# Altium schematic sheet etapa1_anger_Y.SchDoc
size A4
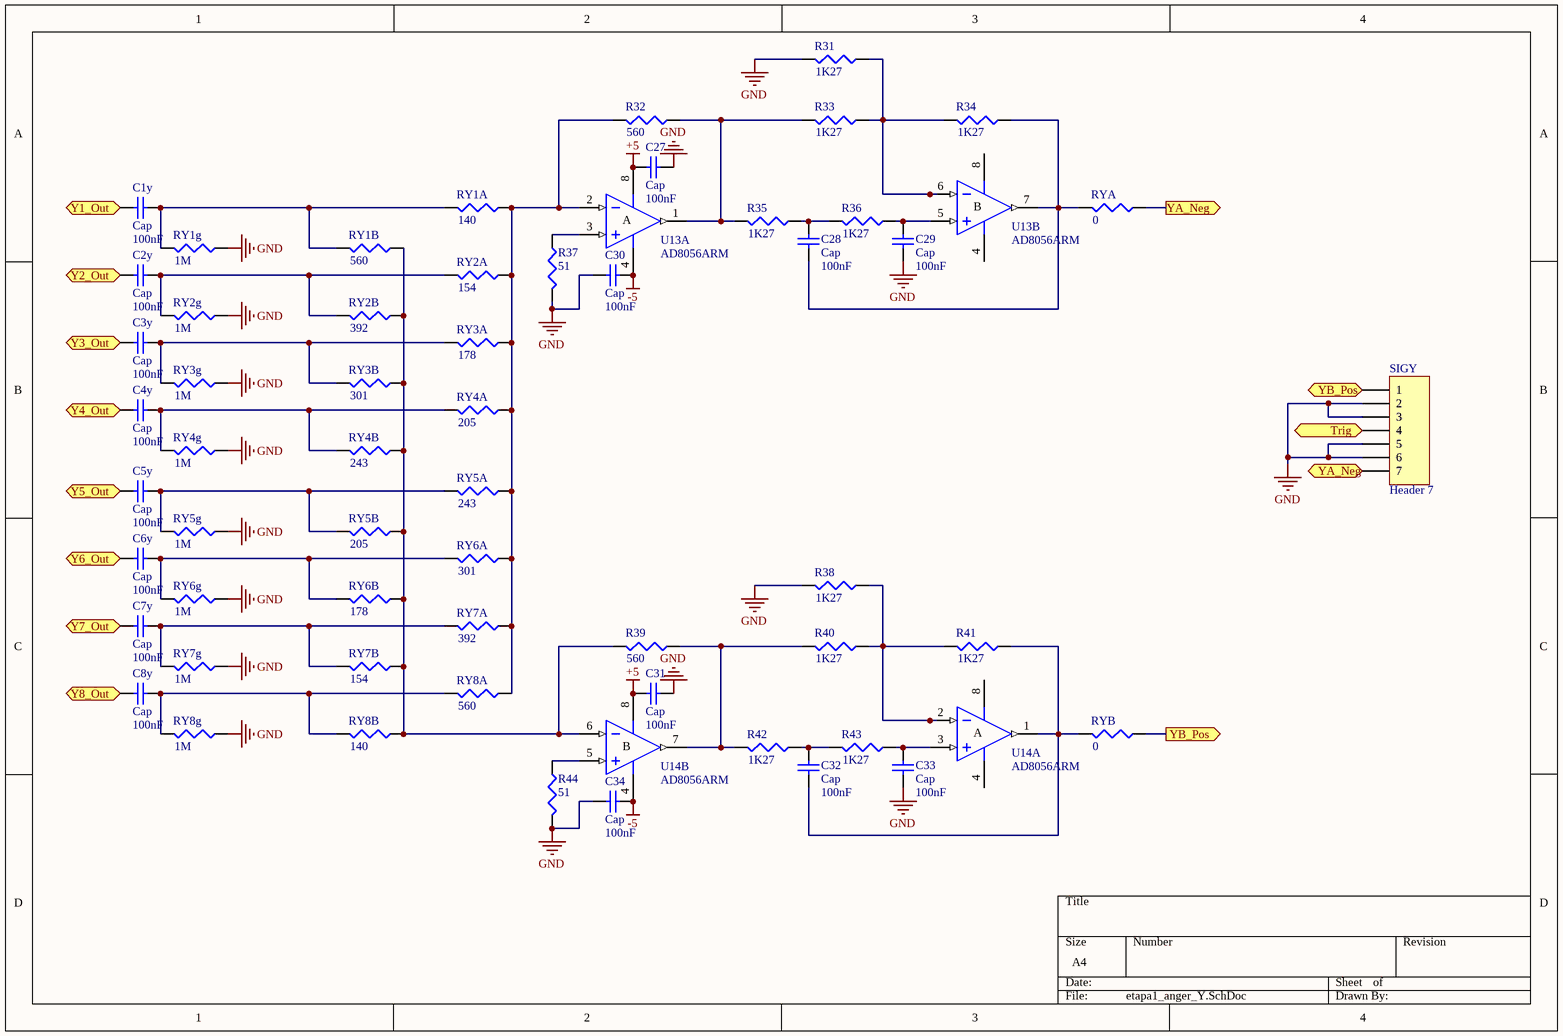
[diagram p0: etapa1_anger_Y.SchDoc]

## Parts
C1y  Cap  value 100nF  [1608[0603]]
C2y  Cap  value 100nF  [1608[0603]]
C3y  Cap  value 100nF  [1608[0603]]
C4y  Cap  value 100nF  [1608[0603]]
C5y  Cap  value 100nF  [1608[0603]]
C6y  Cap  value 100nF  [1608[0603]]
C7y  Cap  value 100nF  [1608[0603]]
C8y  Cap  value 100nF  [1608[0603]]
C27  Cap  value 100nF  [1608[0603]]
C28  Cap  value 100nF  [1608[0603]]
C29  Cap  value 100nF  [1608[0603]]
C30  Cap  value 100nF  [1608[0603]]
C31  Cap  value 100nF  [1608[0603]]
C32  Cap  value 100nF  [1608[0603]]
C33  Cap  value 100nF  [1608[0603]]
C34  Cap  value 100nF  [1608[0603]]
R31  value 1K27  [1608[0603]]  (hidden comment: Res3)
R32  value 560  [0402]  (hidden comment: Res3)
R33  value 1K27  [0402]  (hidden comment: Res3)
R34  value 1K27  [0402]  (hidden comment: Res3)
R35  value 1K27  [0402]  (hidden comment: Res3)
R36  value 1K27  [0402]  (hidden comment: Res3)
R37  value 51  [0402]  (hidden comment: Res3)
R38  value 1K27  [1608[0603]]  (hidden comment: Res3)
R39  value 560  [0402]  (hidden comment: Res3)
R40  value 1K27  [0402]  (hidden comment: Res3)
R41  value 1K27  [0402]  (hidden comment: Res3)
R42  value 1K27  [0402]  (hidden comment: Res3)
R43  value 1K27  [0402]  (hidden comment: Res3)
R44  value 51  [0402]  (hidden comment: Res3)
RY1A  value 140  [0402]  (hidden comment: Res3)
RY1B  value 560  [0402]  (hidden comment: Res3)
RY1g  value 1M  [J1-0603]  (hidden comment: Res3)
RY2A  value 154  [0402]  (hidden comment: Res3)
RY2B  value 392  [0402]  (hidden comment: Res3)
RY2g  value 1M  [J1-0603]  (hidden comment: Res3)
RY3A  value 178  [0402]  (hidden comment: Res3)
RY3B  value 301  [0402]  (hidden comment: Res3)
RY3g  value 1M  [J1-0603]  (hidden comment: Res3)
RY4A  value 205  [0402]  (hidden comment: Res3)
RY4B  value 243  [0402]  (hidden comment: Res3)
RY4g  value 1M  [J1-0603]  (hidden comment: Res3)
RY5A  value 243  [0402]  (hidden comment: Res3)
RY5B  value 205  [0402]  (hidden comment: Res3)
RY5g  value 1M  [J1-0603]  (hidden comment: Res3)
RY6A  value 301  [0402]  (hidden comment: Res3)
RY6B  value 178  [0402]  (hidden comment: Res3)
RY6g  value 1M  [J1-0603]  (hidden comment: Res3)
RY7A  value 392  [0402]  (hidden comment: Res3)
RY7B  value 154  [0402]  (hidden comment: Res3)
RY7g  value 1M  [J1-0603]  (hidden comment: Res3)
RY8A  value 560  [0402]  (hidden comment: Res3)
RY8B  value 140  [0402]  (hidden comment: Res3)
RY8g  value 1M  [J1-0603]  (hidden comment: Res3)
RYA  value 0  [0402]  (hidden comment: Res3)
RYB  value 0  [0402]  (hidden comment: Res3)
SIGY  Header 7  [HDR1X7]
U13  AD8056ARM  [RM-8]  (parts A,B of 2)
U14  AD8056ARM  [RM-8]  (parts A,B of 2)

## Ports
Trig (out), Y1_Out (out), Y2_Out (out), Y3_Out (out), Y4_Out (out), Y5_Out (out), Y6_Out (out), Y7_Out (out), Y8_Out (out), YA_Neg (out), YB_Pos (out)

## Nets
+5: C27.1 C31.1 U13.8(V+) U14.8(V+)
-5: C30.2 C34.2 U13.4(V-) U14.4(V-)
GND: C27.2 C29.2 C30.1 C31.2 C33.2 C34.1 R31.2 R37.2 R38.2 R44.2 RY1g.1 RY2g.1 RY3g.1 RY4g.1 RY5g.1 RY6g.1 RY7g.1 RY8g.1 SIGY.2 SIGY.3 SIGY.5 SIGY.6
Trig: SIGY.4 ; port Trig
Y1_Out: C1y.1 ; port Y1_Out
Y2_Out: C2y.1 ; port Y2_Out
Y3_Out: C3y.1 ; port Y3_Out
Y4_Out: C4y.1 ; port Y4_Out
Y5_Out: C5y.1 ; port Y5_Out
Y6_Out: C6y.1 ; port Y6_Out
Y7_Out: C7y.1 ; port Y7_Out
Y8_Out: C8y.1 ; port Y8_Out
YA_Neg: RYA.1 SIGY.7 ; port YA_Neg
YB_Pos: RYB.1 SIGY.1 ; port YB_Pos
NetC1y_2: C1y.2 RY1A.2 RY1B.2 RY1g.2
NetC2y_2: C2y.2 RY2A.2 RY2B.2 RY2g.2
NetC3y_2: C3y.2 RY3A.2 RY3B.2 RY3g.2
NetC4y_2: C4y.2 RY4A.2 RY4B.2 RY4g.2
NetC5y_2: C5y.2 RY5A.2 RY5B.2 RY5g.2
NetC6y_2: C6y.2 RY6A.2 RY6B.2 RY6g.2
NetC7y_2: C7y.2 RY7A.2 RY7B.2 RY7g.2
NetC8y_2: C8y.2 RY8A.2 RY8B.2 RY8g.2
NetC28_1: C28.1 R35.1 R36.2
NetC28_2: C28.2 R34.1 RYA.2 U13.7(OUT)
NetC29_1: C29.1 R36.1 U13.5(IN+)
NetC32_1: C32.1 R42.1 R43.2
NetC32_2: C32.2 R41.1 RYB.2 U14.1(OUT)
NetC33_1: C33.1 R43.1 U14.3(IN+)
NetR31_1: R31.1 R33.1 R34.2 U13.6(IN-)
NetR32_1: R32.1 R33.2 R35.2 U13.1(OUT)
NetR32_2: R32.2 RY1A.1 RY2A.1 RY3A.1 RY4A.1 RY5A.1 RY6A.1 RY7A.1 RY8A.1 U13.2(IN-)
NetR37_1: R37.1 U13.3(IN+)
NetR38_1: R38.1 R40.1 R41.2 U14.2(IN-)
NetR39_1: R39.1 R40.2 R42.2 U14.7(OUT)
NetR39_2: R39.2 RY1B.1 RY2B.1 RY3B.1 RY4B.1 RY5B.1 RY6B.1 RY7B.1 RY8B.1 U14.6(IN-)
NetR44_1: R44.1 U14.5(IN+)

## Notes on the sheet
- (in symbol AD8056ARM, part A) A
- (in symbol AD8056ARM, part B) B

## Library data of the parts
C1y C2y C3y C4y C5y C6y C7y C8y C27-C34 = Cap: Capacitor; Published: 8-Jun-2000; LatestRevisionDate: 17-Jul-2002; LatestRevisionNote: Re-released for DXP Platform.; PackageReference: RAD-0.3; Publisher: Altium Limited; PackageDescription: Radial Cap, Thru-Hole; 2 Leads; 0.3 in Pin Spacing
R31-R44 RY1A RY1B RY1g RY2A RY2B RY2g RY3A RY3B RY3g RY4A RY4B RY4g RY5A RY5B RY5g RY6A RY6B RY6g RY7A RY7B RY7g RY8A RY8B RY8g RYA RYB = Res3: Resistor; Published: 8-Jun-2000; LatestRevisionDate: 29-May-2009; LatestRevisionNote: IPC-7351 Footprint Added.; PackageReference: J1-0603; Publisher: Altium Limited; PackageDescription: Chip Resistor
SIGY = Header 7: Header, 7-Pin; LatestRevisionDate: 17-Jul-2002; LatestRevisionNote: Re-released for DXP Platform.; Publisher: Altium Limited
U13 U14 = AD8056ARM: Low Cost, 300MHz Voltage Feedback Amplifier; Published: 8-Jun-2000; LatestRevisionDate: 04-Mar-2005; LatestRevisionNote: Stylized 3D Model Added, PCB footprint pad width decreased.; DatasheetVersion: REV. 0 1997; PackageVersion: 2004; PackageReference: RM-8; Publisher: Altium Limited; PackageDescription: Shrink Small Outline, MSOP; 8 Leads; Body Width 3 mm; Pitch 0.65 mm; Code_JEDEC: MO-187-AA; ComponentLink1Description: Manufacturer Link; ComponentLink1URL: http://www.analog.com/en/prod/0,,759_786_AD8055%2C00.html; ComponentLink2Description: Datasheet; ComponentLink2URL: http://www.analog.com/UploadedFiles/Data_Sheets/40402558757264AD8055_6_i.pdf